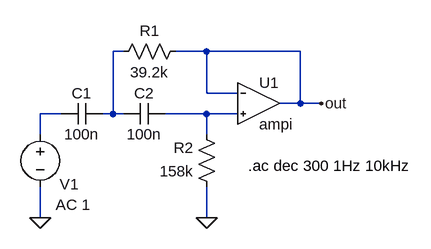
[diagram p0: schematic sk_pasaaltos.asc]
sk_pasaaltos.asc, the LTspice schematic file:
Version 4
SHEET 1 880 680
WIRE 112 96 96 96
WIRE 240 96 192 96
WIRE 384 96 240 96
WIRE 240 160 240 96
WIRE 288 160 240 160
WIRE 384 176 384 96
WIRE 384 176 352 176
WIRE 416 176 384 176
WIRE 16 192 -16 192
WIRE 96 192 96 96
WIRE 96 192 80 192
WIRE 112 192 96 192
WIRE 240 192 176 192
WIRE 288 192 240 192
WIRE -16 224 -16 192
WIRE 240 224 240 192
WIRE -16 352 -16 304
WIRE 240 352 240 304
FLAG 240 352 0
FLAG -16 352 0
FLAG 416 176 out
SYMBOL cap 80 176 R90
WINDOW 0 0 32 VBottom 2
WINDOW 3 32 32 VTop 2
SYMATTR InstName C1
SYMATTR Value 100n
SYMBOL cap 176 176 R90
WINDOW 0 0 32 VBottom 2
WINDOW 3 32 32 VTop 2
SYMATTR InstName C2
SYMATTR Value 100n
SYMBOL res 208 80 R90
WINDOW 0 0 56 VBottom 2
WINDOW 3 32 56 VTop 2
SYMATTR InstName R1
SYMATTR Value 39.2k
SYMBOL res 256 320 R180
WINDOW 0 36 76 Left 2
WINDOW 3 36 40 Left 2
SYMATTR InstName R2
SYMATTR Value 158k
SYMBOL Circuitos2\\ComponentesIdeales\\ampi 320 112 R0
SYMATTR InstName U1
SYMBOL voltage -16 208 R0
WINDOW 0 30 92 Left 2
WINDOW 123 24 124 Left 2
WINDOW 39 0 0 Left 0
SYMATTR InstName V1
SYMATTR Value ""
SYMATTR Value2 AC 1
TEXT 304 272 Left 2 !.ac dec 300 1Hz 10kHz

The netlist it stands for:
* sk_pasaaltos.asc
C1 N001 N002 100n
C2 N003 N001 100n
R1 out N001 39.2k
R2 0 N003 158k
XU1 N003 out out ampi Ren=1e9, Rsal=1, A=1e9  ; pins p n s
V1 N002 0 AC 1
.ac dec 300 1Hz 10kHz
.lib ..\sym\Circuitos2\ComponentesIdeales\compoideales.lib
.backanno
.end